# Altium project MD070B.PrjPcb (part 1 of 2)
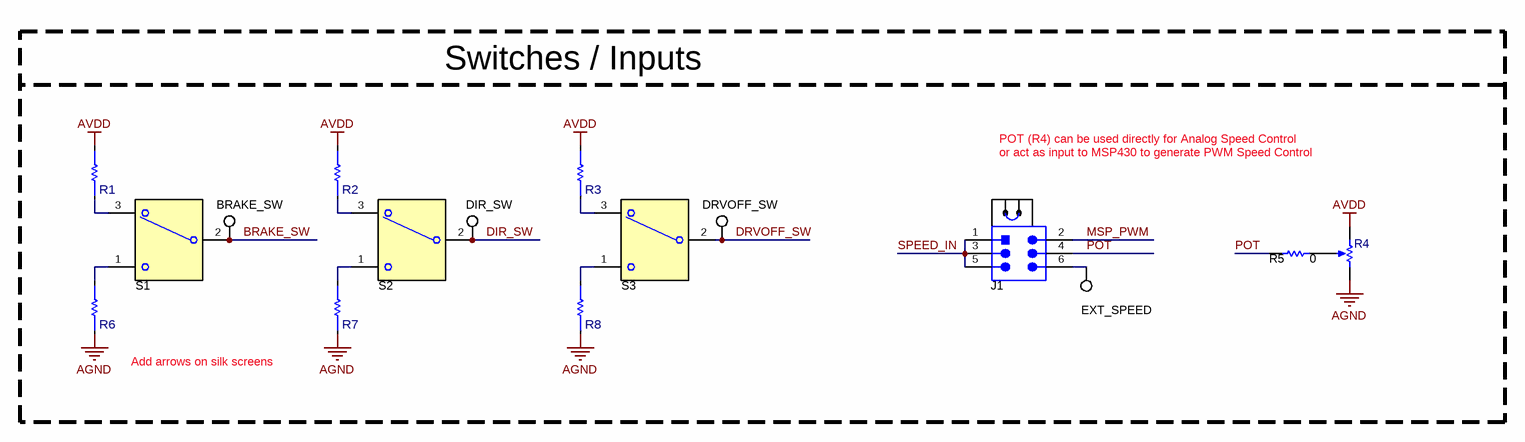
[diagram p0: MD070B_CONTROL.SchDoc]
TID: N/A; TechSupport: http://www.ti.com/support; SCH_Rev: B; ProjectVariant: EVM_Orderable; PRJ_Title: MCx8315AEVM; PRJ_Number: MD070; PRJ_Engineer: Eric Chen; PRJ_Customer: Public Release; PCB_Rev: B; PCB_Layout: Eric Chen; CopyrightYear: 2022
5 sheets, 162 parts. Net scope: global (net labels, ports and power ports of the same name join across sheets).
Board file: MD070B.PcbDoc
Sheets:
  MD070B_CONTROL.SchDoc
  MD070B_DRIVER.SchDoc
  MD070B_HARDWARE.SchDoc
  MD070B_INTERFACE.SchDoc
  MD070B_POWER_AND_CONNECTORS.SchDoc

## Sheet MD070B_CONTROL.SchDoc
size 431 x 279 mm; Date: Not shown in title block; ApprovedBy: Not shown in title block; CheckedBy: Not shown in title block; Author: Not shown in title block; CompanyName: Not shown in title block; Engineer: Not shown in title block; Organization: Not shown in title block; Address1: Not shown in title block; Address2: Not shown in title block; Address3: Not shown in title block; Address4: Not shown in title block; DocumentNumber: 1; Revision: Use project parameter SCH_Rev; SheetNumber: 2; SheetTotal: 5; PageSetup: Record=PageOptions|CenterHorizontal=True|CenterVertical=True|PrintScale=1.00|XCorrection=1.00|YCorrection=1.00|PrintKind=0|BorderSize=5000000|LeftOffset=0|BottomOffset=0|Orientation=2|PaperLength=1000|PaperWidth=1000|Scale=100|PaperSource=15|PrintQuality=600|MediaType=1|DitherType=10|PaperKind=Letter|PrintScaleMode=1; CurrentTime: Not shown in title block; CurrentDate: Not shown in title block; Time: Not shown in title block; DocumentFullPathAndName: Not shown in title block; DocumentName: Not shown in title block; ModifiedDate: Not shown in title block; ImagePath: Not shown in title block

### Parts
J1  Header_3x2  [TSW-103-07-G-D]  (value not drawn)
R1  ERA-3ARB103V  [FP-ERA-3ARB103V_0603-MFG]  (value not drawn)
R2  ERA-3ARB103V  [FP-ERA-3ARB103V_0603-MFG]  (value not drawn)
R3  ERA-3ARB103V  [FP-ERA-3ARB103V_0603-MFG]  (value not drawn)
R4  3352T-1-253LF  [Bourns_3352T]  (value not drawn)
R5  ValueDisplayed: 0  [0603L]  (hidden comment: ERJ-3GEY0R00V)
R6  ERA-3ARB103V  [FP-ERA-3ARB103V_0603-MFG]  (value not drawn)
R7  ERA-3ARB103V  [FP-ERA-3ARB103V_0603-MFG]  (value not drawn)
R8  ERA-3ARB103V  [FP-ERA-3ARB103V_0603-MFG]  (value not drawn)
S1  SW_SPDT_COM2_1_3  [SW_B12AP]  (value not drawn)
S2  SW_SPDT_COM2_1_3  [SW_B12AP]  (value not drawn)
S3  SW_SPDT_COM2_1_3  [SW_B12AP]  (value not drawn)
SH-J1  SNT-100-BK-G  [SNT-100-BK-G]  (value not drawn)
TP1  EXT_SPEED  [Keystone5002]
TP2  BRAKE_SW  [Keystone5002]
TP3  DIR_SW  [Keystone5002]
TP4  DRVOFF_SW  [Keystone5002]

### Nets
AGND: R4.3(CW) R6.1 R7.1 R8.1
AVDD: R1.2 R2.2 R3.2 R4.1(CCW)
BRAKE_SW: S1.2(COM) TP2.1
DIR_SW: S2.2(COM) TP3.1
DRVOFF_SW: S3.2(COM) TP4.1
MSP_PWM: J1.2
POT: J1.4 R5.1
SPEED_IN: J1.1 J1.3 J1.5
NetJ1_6: J1.6 TP1.1
NetR1_1: R1.1 S1.3
NetR2_1: R2.1 S2.3
NetR3_1: R3.1 S3.3
NetR4_2: R4.2(WIPER) R5.2
NetR6_2: R6.2 S1.1
NetR7_2: R7.2 S2.1
NetR8_2: R8.2 S3.1

### Notes on the sheet
- Switches / Inputs
- POT (R4) can be used directly for Analog Speed Control
- or act as input to MSP430 to generate PWM Speed Control
- Add arrows on silk screens
- Drawn By:
- SVN Rev:
- Number:
- TID #:
- Orderable:
- Rev:
- Sheet Title:
- File:
- Project Title:
- Designed for:
- Assembly Variant:
- Mod. Date:
- Sheet:
- Size:
- of
- B
- http://www.ti.com
- Texas Instruments and/or its licensors do not warrant the accuracy or completeness of this specification or any information contained therein. Texas Instruments and/or its licensors do not warrant that this design will meet the specifications, will be suitable for your application or fit for any particular purpose, or will operate in an implementation. Texas Instruments and/or its licensors do not warrant that the design is production worthy. You should completely validate and test your design implementation to confirm the system functionality for your application.
- Engineer:
- Contact:
- © Texas Instruments

### Library data of the parts
J1 = CMP-0075406-2: Header, 100mil, 3x2, Gold, TH; Manufacturer: Samtec; Pitch_mm: 2.54; Gender: Male; Shrouded: N; Row_Count: 2; Current_A: 6.3A; Voltage_V: 550V; Cert_CSA: Y; Green_Lifecycle: Active; Green_REACh: Passed; PartNumber: TSW-103-07-G-D; PackageReference: 3x2 Header; ClassName: Header; CompType: Header; RoHS: Y; MountType: TH; ComponentLink1Description: Datasheet URL; ComponentLink1URL: http://samtec.com/ftppub/pdf/TSW_TH.PDF; Orientation: Vertical; PinCount: 6; RowSpacing_mm: 2.54; ContactFinish: Gold; Color: Black; Cert_UL: Y; Cert_CULUS: N; Cert_VDE: N; Supplier 1: Digi-Key; Supplier Part Number 1: SAM1028-03-ND; Green_EU RoHS: Passed; Green_EU RoHS-2: Passed
R1-R3 R6-R8 = CMP-0092019-1: Res Thin Film 0603 10K Ohm 0.1% 1/10W ±10ppm/°C Molded SMD SMD Punched Carrier T/R; Manufacturer: Panasonic; AEC Grade: Grade 0; Power_W: 100mW; VDC_V: 75V; SizeZ_mm: 0.55mm; AEC Qualified: Yes; Res_ohm: 10k; Supplier 2: Mouser; ComponentLink1URL: https://industrial.panasonic.com/cdbs/www-data/pdf/RDM0000/AOA0000C307.pdf; Supplier Part Number 1: P10KBDCT-ND; RoHS: TRUE; Value: 10k; PartNumber: ERA-3ARB103V; PackageReference: 0603; Supplier 1: Digikey; ComponentLink1Description: Datasheet; Tolerance_%: 0.1%; Supplier Part Number 2: 667-ERA-3ARB103V; TempCo: 10ppm/°C; Technology: Thin Film; Mouser Description: Res Thin Film 0603 10K Ohm 0.1% 1/10W ±10ppm/°C Molded SMD SMD Punched Carrier T/R; Digikey Part Number: P10KBDCT-ND; Operating Temperature Range: -55°C to +155°C; Mouser Part Number: 667-ERA-3ARB103V; Part Number: ERA-3ARB103V; Series: ERA; Lead Free: Yes; Digikey Description: RES SMD 10K OHM 0.1% 1/10W 0603; helpURL: https://upverter.com/upn/revision/497126050f1df72a/; datasheet: https://industrial.panasonic.com/cdbs/www-data/pdf/RDM0000/AOA0000C307.pdf; Datasheet Path: datasheets/Res-ERA-3ARB103V.pdf
R4 = CMP-0001776-2: Trimmer Potentiometer, 25kohm, 0.5W, TH; Manufacturer: Bourns; Value: 25 kohm; Publisher: Texas Instruments; MountType: TH; ComponentLink1Description: Datasheet URL; Supplier 2: Newark; Supplier 3: Mouser; Supplier 1: Digi-Key; Supplier Part Number 1: 3352T-253LF-ND; Supplier Part Number 2: 32K8170; Supplier Part Number 3: 652-3352T-1-253LF; LatestRevisionDate: 09/03/2017; PartNumber: 3352T-1-253LF; PackageReference: 9.53x8.89mm; CompType: Trimmer; RoHS: Y; ComponentLink1URL: http://www.bourns.com/data/global/PDFs/3352.pdf
R5 = CMP-0025874-4: RES, 0, 5%, 0.1 W, AEC-Q200 Grade 0, 0603; Manufacturer: Panasonic; Power_W: 100mW; TempCo: 600 ppm/C; Value_Code: 0000; Value: 0; EIA_Code: E24; SizeX_mm: 1.6; SizeY_mm: 0.8; SizeZ_mm: 1; Value2: 0.1W; SizeArea_mm2: 1.28; AEC Qualified: Y; VDC_V: 50V; AEC Category: Q200; SizeAreaWB_mm2: 4.68; Supplier Part Number 2: 667-ERJ-3GEY0R00V; Supplier 2: Mouser; Supplier Part Number 3: 2059527; Supplier 3: Farnell; RoHS: Y; Value1: 5%; MountType: SMT; Supplier 1: Digi-Key; PackageReference: 0603; Tolerance_%: 5%; Res_ohm: 0; CompType: Resistor; PartNumber: ERJ-3GEY0R00V; ComponentLink1Description: Datasheet link; Supplier Part Number 1: P0.0GCT-ND; Technology: Thick Film; ComponentLink1URL: https://industrial.panasonic.com/cdbs/www-data/pdf/RDA0000/AOA0000C301.pdf; AEC Grade: 0
S1-S3 = CMP-0002155-2: SWITCH TOGGLE SPDT 0.4VA 28V; PartNumber: B12AP; Manufacturer: NKK Switches; SwitchFunction: On-On; PositionCount: 2; CurrentRating_mA: 100A; MountType: TH; ComponentLink1Description: Datasheet URL; ComponentLink1URL: http://www.nkkswitches.com/pdf/Btoggles.pdf; RoHS: Y; Circuit: SPDT; VDC_V: 28V; Orientation: Top Actuated; CompType: Switch; PackageReference: 6.8x23.1x8.8mm; Publisher: Texas Instruments; LatestRevisionDate: 2017-03-09; Supplier 1: Digi-Key; Supplier Part Number 1: 360-1012-ND; Supplier 2: Newark; Supplier Part Number 2: 09X8543; Supplier 3: Mouser; Supplier Part Number 3: 633-B12AP
SH-J1 = CMP-0003623-3: Shunt, 100mil, Gold plated, Black; Alternate PartNumber: 969102-0000-DA; Manufacturer: Samtec; Alternate Manufacturer: 3M; Value: 1x2; ComponentLink1URL: http://www.samtec.com/ftppub/pdf/SNT.PDF; Supplier 1: Digi-Key; CompType: Shunt; PackageReference: Shunt; ClassName: Shunt; RoHS: Y; Supplier Part Number 1: SAM8858-ND; MountType: N/A; PartNumber: SNT-100-BK-G; ComponentLink1Description: Datasheet Link
TP1-TP4 = CMP-0055139-1: Test Point, Miniature, White, TH; Manufacturer: Keystone; CNHeader: FALSE; Green_Lifecycle: Active; Green_REACh: Passed; ContactFinish: Silver; CT: TRUE; ComponentLink1URL: http://www.keyelco.com/userAssets/file/M60-2p60.pdf; Supplier Part Number 2: 82H9632; Publisher: Texas Instruments; Supplier 2: Newark; Supplier Part Number 3: 534-5002; Color: White; Supplier 3: Mouser; RoHS: Y; MountType: TH; Green_EU RoHS-2: Passed; Supplier 1: Digi-Key; Green_EU RoHS: Passed; PackageReference: White Miniature Testpoint; CompType: Test Point; LatestRevisionDate: 26/05/2017; PartNumber: 5002; ComponentLink1Description: Datasheet URL; Supplier Part Number 1: 36-5002-ND

## Sheet MD070B_DRIVER.SchDoc
size 431 x 279 mm; Date: Not shown in title block; ApprovedBy: Not shown in title block; CheckedBy: Not shown in title block; Author: Not shown in title block; CompanyName: Not shown in title block; Engineer: Not shown in title block; Organization: Not shown in title block; Address1: Not shown in title block; Address2: Not shown in title block; Address3: Not shown in title block; Address4: Not shown in title block; DocumentNumber: 2; Revision: Use project parameter SCH_Rev; SheetNumber: 3; SheetTotal: 5; PageSetup: Record=PageOptions|CenterHorizontal=True|CenterVertical=True|PrintScale=1.00|XCorrection=1.00|YCorrection=1.00|PrintKind=0|BorderSize=5000000|LeftOffset=0|BottomOffset=0|Orientation=2|PaperLength=1000|PaperWidth=1000|Scale=100|PaperSource=15|PrintQuality=600|MediaType=1|DitherType=10|PaperKind=Letter|PrintScaleMode=1; CurrentTime: Not shown in title block; CurrentDate: Not shown in title block; Time: Not shown in title block; DocumentFullPathAndName: Not shown in title block; DocumentName: Not shown in title block; ModifiedDate: Not shown in title block; ImagePath: Not shown in title block
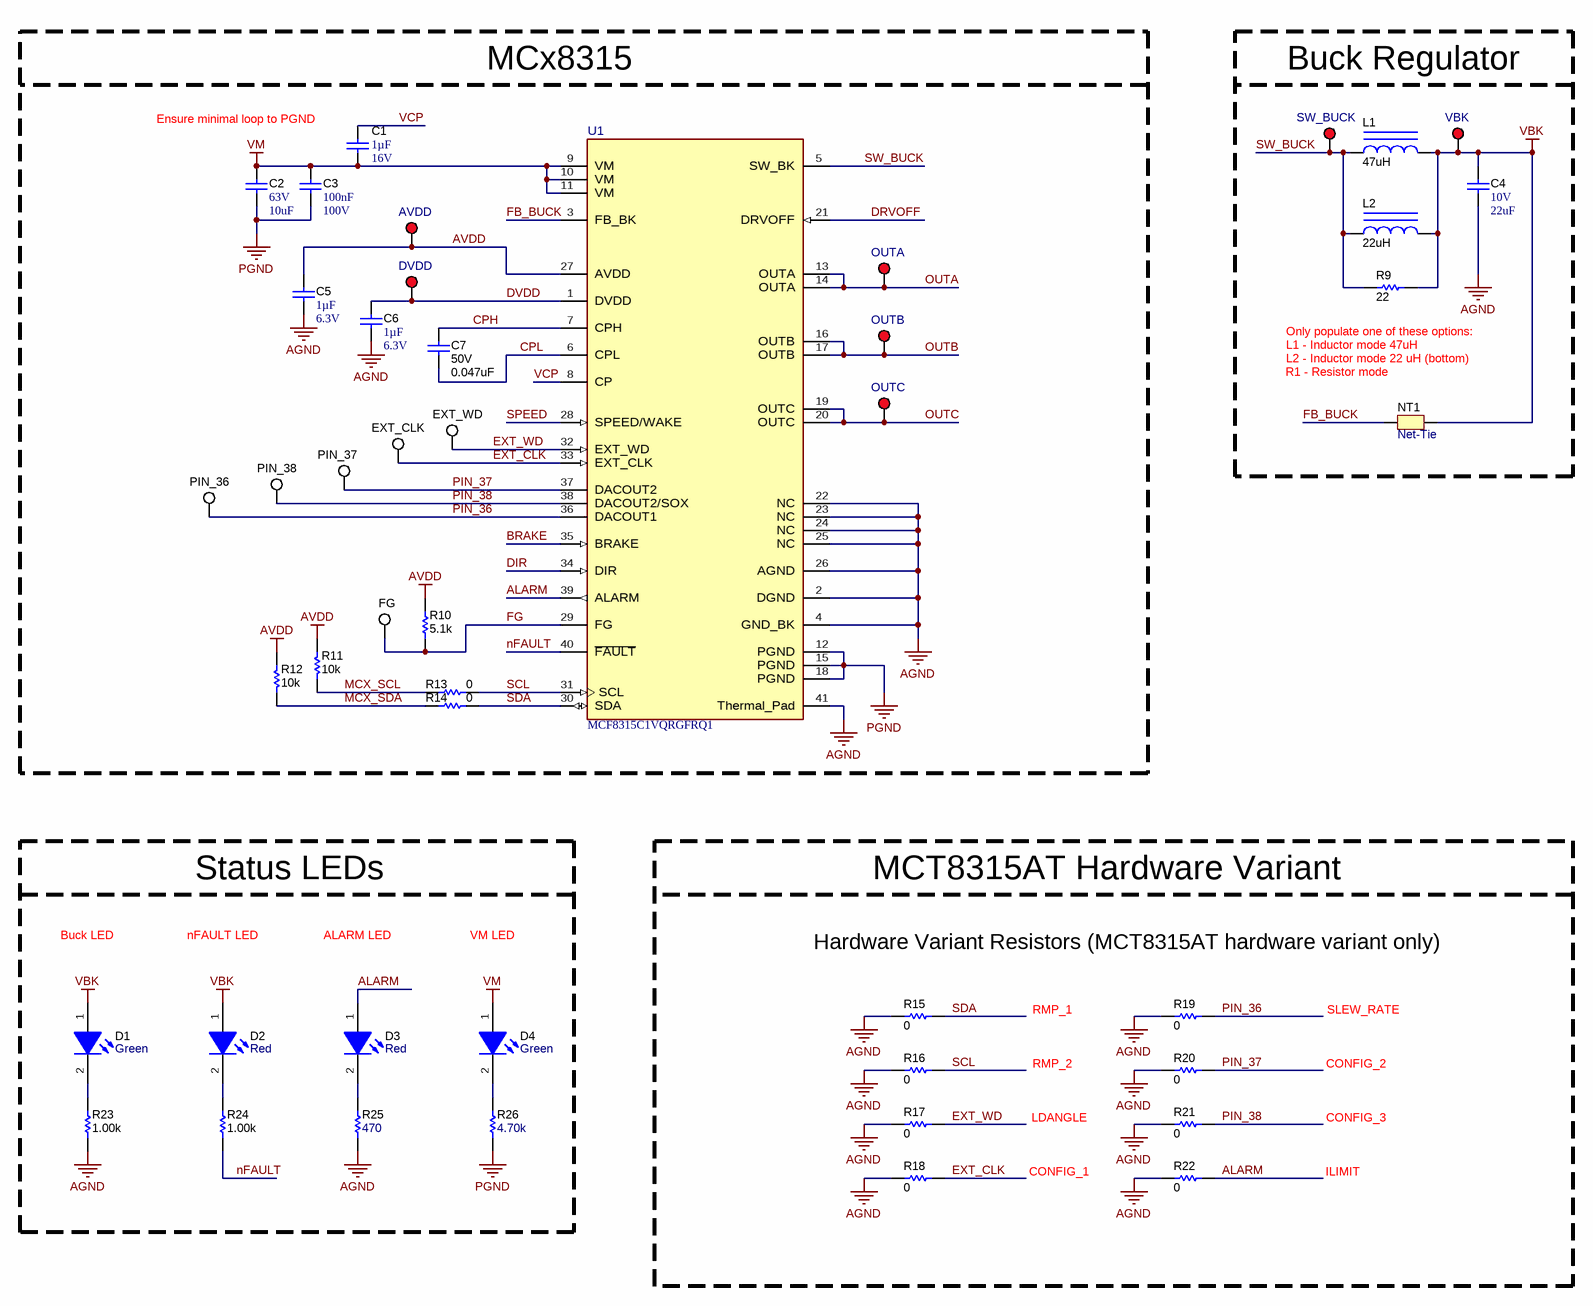
[diagram p1: MD070B_DRIVER.SchDoc]

### Parts
C1  Cap_F: 1µF  VDC_V: 16V  [0603L]  (hidden comment: EMK107B7105KAHT)
C2  VDC_V: 63V  ValueDisplayed: 10uF  [1210_270L]  (hidden comment: GRM32ER71J106KA12L)
C3  Cap_F: 100nF  VDC_V: 100V  [0603]  (hidden comment: GRM188R72A104KA35D)
C4  VDC_V: 10V  ValueDisplayed: 22uF  [1206_180L]  (hidden comment: GRM31CR71A226KE15L)
C5  Cap_F: 1µF  VDC_V: 6.3V  [0603L]  (hidden comment: C0603C105K9RACAUTO)
C6  Cap_F: 1µF  VDC_V: 6.3V  [0603L]  (hidden comment: C0603C105K9RACAUTO)
C7  VDC_V: 50V  ValueDisplayed: 0.047uF  [0402L]  (hidden comment: C1005X7R1H473K050BB)
D1  value Green  [LTST-C170KGKT_Green]  (hidden comment: LTST-C170KGKT)
D2  value Red  [LED_LTST-C170_Red]  (hidden comment: LTST-C170KRKT)
D3  value Red  [LED_LTST-C170_Red]  (hidden comment: LTST-C170KRKT)
D4  value Green  [LTST-C170KGKT_Green]  (hidden comment: LTST-C170KGKT)
L1  ValueDisplayed: 47uH  [WE-MAIA_3015]  (hidden comment: 78438335470)
L2  ValueDisplayed: 22uH  [WE-MAIA_3015]  (hidden comment: 78438335220)
NT1  Net-Tie  [Net-Tie_10mil]  (net tie, no BOM)
R9  ValueDisplayed: 22  [2512]  (hidden comment: CRCW251222R0JNEGHP)
R10  ValueDisplayed: 5.1k  [0603L]  (hidden comment: CRCW06035K10JNEA)
R11  ValueDisplayed: 10k  [0603]  (hidden comment: CRCW060310K0JNEA)
R12  ValueDisplayed: 10k  [0603]  (hidden comment: CRCW060310K0JNEA)
R13  ValueDisplayed: 0  [0603L]  (hidden comment: ERJ-3GEY0R00V)
R14  ValueDisplayed: 0  [0603L]  (hidden comment: ERJ-3GEY0R00V)
R15  ValueDisplayed: 0  [0603L]  (hidden comment: ERJ-3GEY0R00V)
R16  ValueDisplayed: 0  [0603L]  (hidden comment: ERJ-3GEY0R00V)
R17  ValueDisplayed: 0  [0603L]  (hidden comment: ERJ-3GEY0R00V)
R18  ValueDisplayed: 0  [0603L]  (hidden comment: ERJ-3GEY0R00V)
R19  ValueDisplayed: 0  [0603L]  (hidden comment: ERJ-3GEY0R00V)
R20  ValueDisplayed: 0  [0603L]  (hidden comment: ERJ-3GEY0R00V)
R21  ValueDisplayed: 0  [0603L]  (hidden comment: ERJ-3GEY0R00V)
R22  ValueDisplayed: 0  [0603L]  (hidden comment: ERJ-3GEY0R00V)
R23  ValueDisplayed: 1.00k  [0603]  (hidden comment: RC0603FR-071KL)
R24  ValueDisplayed: 1.00k  [0603]  (hidden comment: RC0603FR-071KL)
R25  ValueDisplayed: 470  [0603]  (hidden comment: RC0603JR-07470RL)
R26  ValueDisplayed: 4.70k  [0603L]  (hidden comment: RT0603BRD074K7L)
TP5  SW_BUCK  [Keystone5000]
TP6  VBK  [Keystone5000]
TP7  AVDD  [Keystone5000]
TP8  DVDD  [Keystone5000]
TP9  OUTA  [Keystone5000]
TP10  OUTB  [Keystone5000]
TP11  OUTC  [Keystone5000]
TP12  EXT_WD  [Keystone5002]
TP13  EXT_CLK  [Keystone5002]
TP14  PIN_37  [Keystone5002]
TP15  PIN_38  [Keystone5002]
TP16  PIN_36  [Keystone5002]
TP17  FG  [Keystone5002]
U1  MCF8315C1VQRGFRQ1  [RGF0040F-MFG]

### Blocks framed on the sheet
MCx8315: C1-C3 C5-C7 R10-R14 TP7-TP17 U1
Buck Regulator: C4 L1 L2 NT1 R9 TP5 TP6
Status LEDs: D1-D4 R23-R26
MCT8315AT Hardware Variant: R15-R22

### Nets
AGND: C4.2 C5.1 C6.1 R15.2 R16.2 R17.2 R18.2 R19.2 R20.2 R21.2 R22.2 R23.1 R25.1 U1.2(DGND) U1.4(GND_BK) U1.22(NC) U1.23(NC) U1.24(NC) U1.25(NC) U1.26(AGND) U1.41(Thermal_Pad)
AVDD: C5.2 R10.2 R11.1 R12.1 TP7.1 U1.27(AVDD)
PGND: C2.2 C3.2 R26.1 U1.12(PGND) U1.15(PGND) U1.18(PGND)
VBK: C4.1 D1.1(A) D2.1(A) L1.2 L2.2 NT1.2 R9.2 TP6.1
VM: C1.2 C2.1 C3.1 D4.1(A) U1.9(VM) U1.10(VM) U1.11(VM)
ALARM: D3.1(A) R22.1 U1.39(ALARM)
BRAKE: U1.35(BRAKE)
CPH: C7.1 U1.7(CPH)
CPL: C7.2 U1.6(CPL)
DIR: U1.34(DIR)
DRVOFF: U1.21(DRVOFF)
DVDD: C6.2 TP8.1 U1.1(DVDD)
EXT_CLK: R18.1 TP13.1 U1.33(EXT_CLK)
EXT_WD: R17.1 TP12.1 U1.32(EXT_WD)
FB_BUCK: NT1.1 U1.3(FB_BK)
FG: R10.1 TP17.1 U1.29(FG)
MCX_SCL: R11.2 R13.1
MCX_SDA: R12.2 R14.1
nFAULT: R24.1 U1.40(~{FAULT})
OUTA: TP9.1 U1.13(OUTA) U1.14(OUTA)
OUTB: TP10.1 U1.16(OUTB) U1.17(OUTB)
OUTC: TP11.1 U1.19(OUTC) U1.20(OUTC)
PIN_36: R19.1 TP16.1 U1.36(DACOUT1)
PIN_37: R20.1 TP14.1 U1.37(DACOUT2)
PIN_38: R21.1 TP15.1 U1.38(DACOUT2/SOX)
SCL: R13.2 R16.1 U1.31(SCL)
SDA: R14.2 R15.1 U1.30(SDA)
SPEED: U1.28(SPEED/WAKE)
SW_BUCK: L1.1 L2.1 R9.1 TP5.1 U1.5(SW_BK)
VCP: C1.1 U1.8(CP)
NetD1_2: D1.2(K) R23.2
NetD2_2: D2.2(K) R24.2
NetD3_2: D3.2(K) R25.2
NetD4_2: D4.2(K) R26.2

### Notes on the sheet
- Ensure minimal loop to PGND
- (near NT1) R1 - Resistor mode
- L1 - Inductor mode 47uH
- L2 - Inductor mode 22 uH (bottom)
- (near R9) Only populate one of these options:
- Buck LED
- nFAULT LED
- ALARM LED
- VM LED
- Hardware Variant Resistors (MCT8315AT hardware variant only)
- RMP_1
- RMP_2
- CONFIG_2
- SLEW_RATE
- LDANGLE
- CONFIG_3
- CONFIG_1
- ILIMIT
- Drawn By:
- SVN Rev:
- Number:
- TID #:
- Orderable:
- Rev:
- Sheet Title:
- File:
- Project Title:
- Designed for:
- Assembly Variant:
- Mod. Date:
- Sheet:
- Size:
- of
- B
- http://www.ti.com
- Texas Instruments and/or its licensors do not warrant the accuracy or completeness of this specification or any information contained therein. Texas Instruments and/or its licensors do not warrant that this design will meet the specifications, will be suitable for your application or fit for any particular purpose, or will operate in an implementation. Texas Instruments and/or its licensors do not warrant that the design is production worthy. You should completely validate and test your design implementation to confirm the system functionality for your application.
- Engineer:
- Contact:
- © Texas Instruments

### Library data of the parts
C1 = CMP-0080104-1: CAP, CERM, 1 µF, 16 V,+/- 10%, X7R, AEC-Q200 Grade 1, 0603; Manufacturer: Taiyo Yuden; SizeAreaWB_mm2: 4.68; SizeArea_mm2: 1.28; AEC Qualified: Y; AEC Category: Q200; Value: 1uF; TaMax_C: 125°C; SizeZ_mm: 1; Polarized: N; TaMin_C: -55°C; SizeY_mm: 0.8; U/M: EA; SizeX_mm: 1.6; Cap_Case: 0603; ComponentLink1Description: Datasheet link; RoHS: Y; Supplier Part Number 3: 963-EMK107B7105KAHT; Tolerance_%: 10%; Supplier 1: Digi-Key; PackageReference: 0603; Technology: Ceramic; PartNumber: EMK107B7105KAHT; TempCo: X7R; Supplier Part Number 2: 68X1305; Supplier 2: Newark; AEC Grade: 1; Value2: 16V; ComponentLink1URL: https://www.yuden.co.jp/productdata/catalog/mlcc01_hq_e.pdf; CompType: Capacitor; MountType: SMT; Supplier Part Number 1: 587-3305-1-ND; Supplier 3: Mouser; ValueDisplayed: 1µF
C2 = CMP-0009229-2: CAP, CERM, 10 uF, 63 V, +/- 10%, X7R, 1210; Manufacturer: MuRata; TaMin_C: -55°C; Polarized: N; SizeAreaWB_mm2: 14.7; Value1: Unknown; U/M: EA; Value: 10uF; TaMax_C: 125°C; SizeZ_mm: 2.7; SizeX_mm: 3.2; SizeY_mm: 2.5; Cap_Case: 1210; SizeArea_mm2: 8; Cap_F: 10µF; AEC Category: Q200; Supplier Part Number 2: 81-GRM32ER71J106KA2L; Publisher: Texas Instruments; Supplier 2: Mouser; TempCo: X7R; Published: 2008-06-19; RoHS: Y; MountType: SMT; Supplier 1: Digi-Key; PackageReference: 1210; Tolerance_%: 10%; Value2: 63V; CompType: Capacitor; LatestRevisionDate: 2017-03-09; PartNumber: GRM32ER71J106KA12L; AEC Qualified: N; ComponentLink1Description: Datasheet link; AEC Grade: N/A; Supplier Part Number 1: 490-9970-1-ND; Technology: Ceramic; ComponentLink1URL: http://psearch.en.murata.com/capacitor/product/GRM32ER71J106KA12%23.pdf
C3 = CMP-0007469-4: CAP, CERM, 0.1 uF, 100 V, +/- 10%, X7R, 0603; Manufacturer: MuRata; TaMin_C: -55°C; TaMax_C: 125°C; SizeY_mm: 0.8; ValueDisplayed: 0.1uF; SizeZ_mm: 1; Polarized: N; Value1: Unknown; U/M: EA; SizeAreaWB_mm2: 4.68; AEC Category: Q200; SizeArea_mm2: 1.28; Value: 0.1uF; SizeX_mm: 1.6; CompType: Capacitor; AEC Qualified: ?; Supplier 3: Farnell; Technology: Ceramic; TempCo: X7R; RoHS: Y; Cap_Case: 0603; Supplier 1: Digi-Key; Supplier Part Number 1: 490-3285-1-ND; Tolerance_%: 10%; MountType: SMT; ComponentLink1Description: Datasheet link; Supplier Part Number 2: 81-GRM188R72A104KA35; Value2: 100V; PartNumber: GRM188R72A104KA35D; Supplier 2: Mouser; ComponentLink1URL: http://search.murata.co.jp/Ceramy/PnsearchViewAction.do?HnOFG=ON&HnNFG=ON&SEL_CNT=50&sLang=en&sKey=GRM188R72A104KA35D&x=9&y=9&search=startwith; Supplier Part Number 3: 1828921; PackageReference: 0603; Publisher: Texas Instruments; Published: 2008-06-19; LatestRevisionDate: 2017-03-09
C4 = CMP-0008959-2: CAP, CERM, 22 uF, 10 V, +/- 10%, X7R, 1206; Manufacturer: MuRata; TaMin_C: -55°C; Polarized: N; SizeAreaWB_mm2: 10.92; Value1: Unknown; U/M: EA; Value: 22uF; TaMax_C: 125°C; SizeZ_mm: 1.8; SizeX_mm: 3.2; SizeY_mm: 1.6; Cap_Case: 1206; SizeArea_mm2: 5.12; Cap_F: 22µF; AEC Category: Q200; Supplier Part Number 2: 81-GRM31CR71A226K15L; Publisher: Texas Instruments; Supplier 2: Mouser; Supplier Part Number 3: 1797016; TempCo: X7R; Supplier 3: Farnell; Published: 2008-06-19; RoHS: Y; MountType: SMT; Supplier 1: Digi-Key; PackageReference: 1206; Tolerance_%: 10%; Value2: 10V; CompType: Capacitor; LatestRevisionDate: 2017-03-09; PartNumber: GRM31CR71A226KE15L; AEC Qualified: ?; ComponentLink1Description: Datasheet link; Supplier Part Number 1: 490-5309-1-ND; Technology: Ceramic; ComponentLink1URL: http://search.murata.co.jp/Ceramy/PnsearchViewAction.do?HnOFG=ON&HnNFG=ON&SEL_CNT=50&sLang=en&sKey=GRM31CR71A226KE15L&x=9&y=9&search=startwith
C5 C6 = CMP-0086190-1: CAP, CERM, 1 µF, 6.3 V,+/- 10%, X7R, AEC-Q200 Grade 1, 0603; Manufacturer: Kemet; SizeArea_mm2: 1.28; Cap_Case: 0603; SizeY_mm: 0.8; AEC Category: Q200; AEC Qualified: Y; TaMax_C: 125°C; SizeZ_mm: 1; SizeX_mm: 1.6; Polarized: N; Value: 1uF; SizeAreaWB_mm2: 4.68; TaMin_C: -55°C; U/M: EA; ComponentLink1URL: https://content.kemet.com/datasheets/KEM_C1023_X7R_AUTO_SMD.pdf; CompType: Capacitor; PackageReference: 0603; Value2: 6.3V; Technology: Ceramic; RoHS: Y; MountType: SMT; PartNumber: C0603C105K9RACAUTO; AEC Grade: 1; ComponentLink1Description: Datasheet link; TempCo: X7R; Tolerance_%: 10%; ValueDisplayed: 1µF
C7 = CMP-0006298-2: CAP, CERM, 0.047 uF, 50 V, +/- 10%, X7R, 0402; Manufacturer: TDK; TaMin_C: -55°C; ESR_ohm: 0.06407; Polarized: N; SizeAreaWB_mm2: 3; Value1: 0.06407 ohm; U/M: EA; SizeZ_mm: 0.6; SizeX_mm: 1; SizeY_mm: 0.5; Cap_Case: 0402; Cap_F: 47nF; IRMS_A: 646.122mA; AEC Category: Q200; TaMax_C: 125°C; ComponentLink1URL: https://product.tdk.com/en/search/capacitor/ceramic/mlcc/info?part_no=C1005X7R1H473K050BB; Supplier Part Number 2: 04X3233; Publisher: Texas Instruments; Supplier 2: Newark; Supplier Part Number 3: 810-C1005X7R1H473K; TempCo: X7R; Supplier 3: Mouser; Published: 2008-06-19; RoHS: Y; MountType: SMT; Value: 0.047uF; Supplier 1: Digi-Key; PackageReference: 0402; Tolerance_%: 10%; Value2: 50V; SizeArea_mm2: 0.5; CompType: Capacitor; LatestRevisionDate: 2017-03-09; PartNumber: C1005X7R1H473K050BB; AEC Qualified: N; ComponentLink1Description: Datasheet link; AEC Grade: N/A; Supplier Part Number 1: 445-7336-1-ND; Technology: Ceramic
D1 D4 = CMP-0002888-2: LED, Green, SMD; Manufacturer: Lite-On; Io_A: 20mA; Value1: W; Vf_V: 2V; Type: AlInGaP; ComponentLink1URL: http://optoelectronics.liteon.com/upload/download/DS22-2000-073/S_110_LTST-C170KGKT.pdf; Color: Green; RoHS: Y; MountType: SMT; PackageReference: LED_0805; Value2: 2V; CompType: LED; PartNumber: LTST-C170KGKT; ComponentLink1Description: Datasheet link
D2 D3 = CMP-0002829-3: LED, Red, SMD; Manufacturer: Lite-On; Io_A: 20mA; SizeAreaWB_mm2: 6.75; Value1: W; SizeZ_mm: 1.2; SizeX_mm: 2; SizeY_mm: 1.25; Vf_V: 2V; SizeArea_mm2: 2.5; Type: AlInGaP; ComponentLink1URL: http://optoelectronics.liteon.com/upload/download/DS-22-99-0150/P_100_LTST-C170KRKT.pdf; Color: red; RoHS: Y; MountType: SMT; PackageReference: Red 0805 LED; Value2: 2V; CompType: LED; PartNumber: LTST-C170KRKT; ComponentLink1Description: Datasheet link
L1 = CMP-0064683-2: Inductor, Shielded, Powdered Iron, 47 uH, 0.39 A, 2.3 ohm, AEC-Q200 Grade 1, SMD; Manufacturer: Wurth Elektronik; Isat: 1.18A @ 20% inductance drop; Irms: 0.39A @ 40C rise; SizeAreaWB_mm2: 16; DCR_ohm: 2.3; Value1: 2.3 ohm; Value: 47uH; Imax_A: 390mA; SizeZ_mm: 1.5; SizeX_mm: 3; Value2: 0.39A; SizeArea_mm2: 9; Ind_H: 47µH; AEC Qualified: Y; AEC Grade: 1; AEC Category: Q200; Publisher: Texas Instruments; Published: 2008-06-26; RoHS: Y; Material: Powdered Iron; MountType: SMT; Supplier 1: Digi-Key; PackageReference: SMD, 2-Leads, Body 3x3mm; SizeY_mm: 3; CompType: Inductor; LatestRevisionDate: 2017-06-02; PartNumber: 78438335470; ComponentLink1Description: Datasheet link; Supplier Part Number 1: 732-6947-1-ND; Technology: Shielded; ComponentLink1URL: http://katalog.we-online.de/pbs/datasheet/78438335470.pdf
L2 = CMP-0064681-2: Inductor, Shielded, Powdered Iron, 22 uH, 0.6 A, 1.04 ohm, AEC-Q200 Grade 1, SMD; Manufacturer: Wurth Elektronik; Isat: 1.6A @ 20% inductance drop; Irms: 0.6A @ 40C rise; SizeAreaWB_mm2: 16; DCR_ohm: 1.04; Value: 22uH; Imax_A: 600mA; SizeZ_mm: 1.5; SizeX_mm: 3; Value2: 0.6A; SizeArea_mm2: 9; Ind_H: 22µH; AEC Qualified: Y; AEC Grade: 1; AEC Category: Q200; Publisher: Texas Instruments; Published: 2008-06-26; RoHS: Y; Value1: 1.04 ohm; Material: Powdered Iron; MountType: SMT; Supplier 1: Digi-Key; PackageReference: SMD, 2-Leads, Body 3x3mm; SizeY_mm: 3; CompType: Inductor; LatestRevisionDate: 2017-06-02; PartNumber: 78438335220; ComponentLink1Description: Datasheet link; Supplier Part Number 1: 732-6945-1-ND; Technology: Shielded; ComponentLink1URL: http://katalog.we-online.de/pbs/datasheet/78438335220.pdf
NT1 = CMP-0078142-4: Single point connection between nets.; MountType: SMT; PackageReference: N/A; CompType: Net-Tie; Manufacturer: N/A; PartNumber: N/A; Library Reference: Net-Tie
R9 = CMP-0015919-3: RES, 22, 5%, 1.5 W, AEC-Q200 Grade 0, 2512; Manufacturer: Vishay-Dale; Power_W: 1.5W; TempCo: 200 ppm/C; Value_Code: 22R0; Value: 22; EIA_Code: E24; SizeX_mm: 6.3; SizeY_mm: 3.2; SizeZ_mm: 0.71; SizeArea_mm2: 20.16; AEC Qualified: Y; VDC_V: 500V; AEC Category: Q200; AEC Grade: 0; RoHS: E; Value1: 5%; MountType: SMT; PackageReference: 2512; Tolerance_%: 5%; Res_ohm: 22; Value2: 1.5W; CompType: Resistor; PartNumber: CRCW251222R0JNEGHP; ComponentLink1Description: Datasheet link; Technology: Thick Film; ComponentLink1URL: http://www.vishay.com/docs/20043/crcwhpe3.pdf
R10 = CMP-0025830-4: RES, 5.1 k, 5%, 0.1 W, AEC-Q200 Grade 0, 0603; Manufacturer: Vishay-Dale; Power_W: 100mW; TempCo: 200 ppm/C; Value_Code: 5k10; Value: 5.1k; EIA_Code: E24; SizeX_mm: 1.6; SizeY_mm: 0.8; SizeZ_mm: 1; Value2: 0.1W; SizeArea_mm2: 1.28; AEC Qualified: Y; VDC_V: 75V; AEC Category: Q200; AEC Grade: 0; ComponentLink1URL: http://www.vishay.com/docs/20035/dcrcwe3.pdf; Supplier Part Number 2: 89M6773; Supplier 2: Newark; Supplier Part Number 3: 1570751; Supplier 3: Farnell; RoHS: E; Value1: 5%; MountType: SMT; Supplier 1: Digi-Key; PackageReference: 0603; Tolerance_%: 5%; Res_ohm: 5.1k; CompType: Resistor; PartNumber: CRCW06035K10JNEA; ComponentLink1Description: Datasheet link; Supplier Part Number 1: 541-5.1KGCT-ND; Technology: Thick Film
R11 R12 = CMP-0025701-4: RES, 10 k, 5%, 0.1 W, AEC-Q200 Grade 0, 0603; Manufacturer: Vishay-Dale; Power_W: 100mW; TempCo: 200 ppm/C; Value_Code: 10k0; Value: 10k; EIA_Code: E24; SizeX_mm: 1.6; SizeY_mm: 0.8; SizeZ_mm: 1; Value2: 0.1W; SizeArea_mm2: 1.28; AEC Qualified: Y; VDC_V: 75V; AEC Category: Q200; AEC Grade: 0; Supplier Part Number 2: 52K8066; Supplier 2: Newark; Supplier Part Number 3: 71-CRCW0603J-10K-E3; Supplier 3: Mouser; RoHS: E; Value1: 5%; MountType: SMT; Supplier 1: Digi-Key; PackageReference: 0603; Tolerance_%: 5%; Res_ohm: 10k; CompType: Resistor; PartNumber: CRCW060310K0JNEA; ComponentLink1Description: Datasheet link; Supplier Part Number 1: 541-10KGCT-ND; Technology: Thick Film; ComponentLink1URL: http://www.vishay.com/docs/20035/dcrcwe3.pdf
R13-R22 = CMP-0025874-4: as R5 on sheet MD070B_CONTROL; Supplier Part Number 2: 667-ERJ-3GEY0R00V; Supplier 2: Mouser; Supplier Part Number 3: 2059527; Supplier 3: Farnell; RoHS: Y; Value1: 5%; MountType: SMT; Supplier 1: Digi-Key; PackageReference: 0603; Tolerance_%: 5%; Res_ohm: 0; CompType: Resistor; PartNumber: ERJ-3GEY0R00V; ComponentLink1Description: Datasheet link; Supplier Part Number 1: P0.0GCT-ND; Technology: Thick Film; ComponentLink1URL: https://industrial.panasonic.com/cdbs/www-data/pdf/RDA0000/AOA0000C301.pdf; AEC Grade: 0
R23 R24 = CMP-0022895-5: RES, 1.00 k, 1%, 0.1 W, 0603; Manufacturer: Yageo; Power_W: 100mW; TempCo: 100 ppm/C; Value_Code: 1k00; Value: 1.00k; EIA_Code: E96; Res_ohm: 1k; SizeX_mm: 1.6; SizeY_mm: 0.8; SizeZ_mm: 1; Value2: 0.1W; SizeArea_mm2: 1.28; AEC Qualified: N; VDC_V: 75V; AEC Category: Q200; SizeAreaWB_mm2: 4.68; Supplier Part Number 2: 603-RC0603FR-071KL; Supplier 2: Mouser; Supplier Part Number 3: 9238484; Supplier 3: Farnell; RoHS: Y; Value1: 1%; MountType: SMT; Supplier 1: Digi-Key; PackageReference: 0603; Tolerance_%: 1%; CompType: Resistor; PartNumber: RC0603FR-071KL; ComponentLink1Description: Datasheet link; Supplier Part Number 1: 311-1.00KHRCT-ND; Technology: Thick Film; ComponentLink1URL: http://www.yageo.com/pdf/Pu-RC0603_51_PbFree_L_2.pdf; AEC Grade: N/A
R25 = CMP-0025924-5: RES, 470, 5%, 0.1 W, 0603; Manufacturer: Yageo; Power_W: 100mW; TempCo: 100 ppm/C; Value_Code: 470R; Value: 470; EIA_Code: E24; SizeX_mm: 1.6; SizeY_mm: 0.8; SizeZ_mm: 1; Value2: 0.1W; SizeArea_mm2: 1.28; AEC Qualified: N; VDC_V: 75V; AEC Category: Q200; SizeAreaWB_mm2: 4.68; Supplier Part Number 2: 603-RC0603JR-07470RL; Supplier 2: Mouser; Supplier Part Number 3: 9233334; Supplier 3: Farnell; RoHS: Y; Value1: 5%; MountType: SMT; Supplier 1: Digi-Key; PackageReference: 0603; Tolerance_%: 5%; Res_ohm: 470; CompType: Resistor; PartNumber: RC0603JR-07470RL; ComponentLink1Description: Datasheet link; Supplier Part Number 1: 311-470GRCT-ND; Technology: Thick Film; ComponentLink1URL: http://www.yageo.com/pdf/Pu-RC0603_51_PbFree_L_2.pdf; AEC Grade: N/A
R26 = CMP-0024300-2: RES, 4.70 k, 0.1%, 0.1 W, 0603; Manufacturer: Yageo America; Power_W: 100mW; TempCo: 25 ppm/C; Value_Code: 4k70; U/M: EA; Value: 4.70k; EIA_Code: E192; Res_ohm: 4.7k; SizeX_mm: 1.6; SizeY_mm: 0.8; SizeZ_mm: 1; Value2: 0.1W; SizeArea_mm2: 1.28; VDC_V: 75V; AEC Category: Q200; ComponentLink1URL: http://www.yageo.com/pdf/PYu-RT_1-to-0.05_RoHS_L_3.pdf; Publisher: Texas Instruments; Published: 2008-06-26; RoHS: Y; Value1: 0.1%; MountType: SMT; PackageReference: 0603; Tolerance_%: 0.1%; CompType: Resistor; LatestRevisionDate: 2017-03-09; PartNumber: RT0603BRD074K7L; AEC Qualified: ?; ComponentLink1Description: Datasheet link; Technology: Thin Film
TP5-TP11 = CMP-0055137-1: Test Point, Miniature, Red, TH; PartNumber: 5000; Manufacturer: Keystone; ContactFinish: Silver; CNHeader: FALSE; CT: TRUE; Green_Lifecycle: Active; Green_REACh: Passed; PackageReference: Red Miniature Testpoint; CompType: Test Point; RoHS: Y; MountType: TH; ComponentLink1Description: Datasheet URL; ComponentLink1URL: http://www.keyelco.com/userAssets/file/M60-2p60.pdf; Publisher: Texas Instruments; LatestRevisionDate: 26/05/2017; Supplier 1: Digi-Key; Supplier Part Number 1: 36-5000-ND; Supplier 2: Mouser; Supplier Part Number 2: 534-5000; Color: Red; Green_EU RoHS-2: Incomplete; Green_EU RoHS: Passed
TP12-TP17 = CMP-0055139-1: as TP1 on sheet MD070B_CONTROL; ComponentLink1URL: http://www.keyelco.com/userAssets/file/M60-2p60.pdf; Supplier Part Number 2: 82H9632; Publisher: Texas Instruments; Supplier 2: Newark; Supplier Part Number 3: 534-5002; Color: White; Supplier 3: Mouser; RoHS: Y; MountType: TH; Green_EU RoHS-2: Passed; Supplier 1: Digi-Key; Green_EU RoHS: Passed; PackageReference: White Miniature Testpoint; CompType: Test Point; LatestRevisionDate: 26/05/2017; PartNumber: 5002; ComponentLink1Description: Datasheet URL; Supplier Part Number 1: 36-5002-ND
U1 = CMP-0122421-1: Sensorless Field Oriented Control (FOC) Integrated FET BLDC Driver; Manufacturer: Texas Instruments; SizeZ_mm: 1mm; AEC Qualified: Yes; AEC Grade: Grade 1; Max Supply Voltage: 35V; Min Supply Voltage: 4.5V; Motor Type: Brushless DC; Nominal Supply Current: 11-28mA; Number Of Outputs: 3; Standoff Height: 0mm; TaMax_C: +125°C; TaMin_C: -40°C; TJmax_C: +150°C; PackageReference: VQFN40; PartNumber: MCF8315C1VQRGFRQ1; RoHS: TRUE; Operating Temperature Range: -40°C to +125°C; Part Number: MCF8315C1VQRGFRQ1; datasheet: https://www.ti.com/lit/ds/symlink/mcf8315c-q1.pdf; Datasheet Path: datasheets/IC-MCF8315C1VQRGFRQ1.pdf; Digikey Description: AUTOMOTIVE, 40V MAX, 4A PEAK, SE; Digikey Part Number: 296-MCF8315C1VQRGFRQ1CT-ND; helpURL: https://upverter.com/upn/revision/513decdd14bf9ffb/; Lead Free: Yes; Mouser Part Number: 595-MCF8315C1VQRGFQ1; ComponentLink1Description: Datasheet; ComponentLink1URL: https://www.ti.com/lit/ds/symlink/mcf8315c-q1.pdf

## Sheet MD070B_HARDWARE.SchDoc
size 431 x 279 mm; Date: Not shown in title block; ApprovedBy: Not shown in title block; CheckedBy: Not shown in title block; Author: Not shown in title block; CompanyName: Not shown in title block; Engineer: Not shown in title block; Organization: Not shown in title block; Address1: Not shown in title block; Address2: Not shown in title block; Address3: Not shown in title block; Address4: Not shown in title block; DocumentNumber: 3; Revision: Use project parameter SCH_Rev; SheetNumber: 5; SheetTotal: 5; PageSetup: Record=PageOptions|CenterHorizontal=True|CenterVertical=True|PrintScale=1.00|XCorrection=1.00|YCorrection=1.00|PrintKind=0|BorderSize=5000000|LeftOffset=0|BottomOffset=0|Orientation=2|PaperLength=1000|PaperWidth=1000|Scale=100|PaperSource=15|PrintQuality=600|MediaType=1|DitherType=10|PaperKind=Letter|PrintScaleMode=1; CurrentTime: Not shown in title block; CurrentDate: Not shown in title block; Time: Not shown in title block; DocumentFullPathAndName: Not shown in title block; DocumentName: Not shown in title block; ModifiedDate: Not shown in title block; ImagePath: Not shown in title block
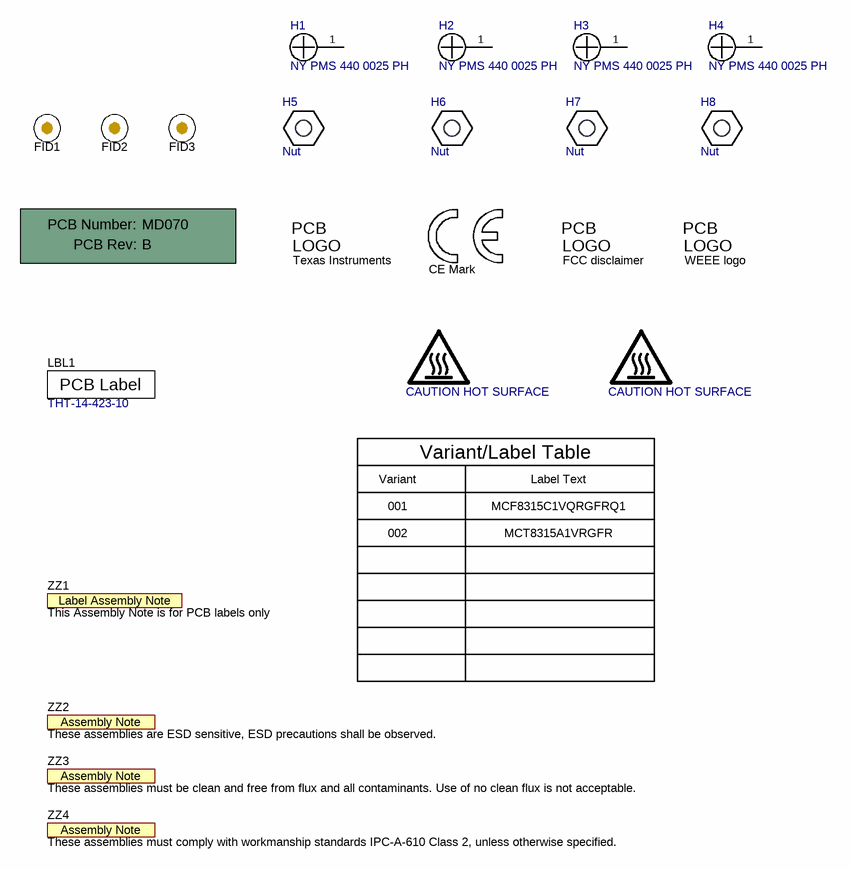
[diagram p2: MD070B_HARDWARE.SchDoc]

### Parts
!PCB1  Printed Circuit Board  (value not drawn)  (mechanical)
FID1  Fiducial  [Fiducial10-20]  (value not drawn)
FID2  Fiducial  [Fiducial10-20]  (value not drawn)
FID3  Fiducial  [Fiducial10-20]  (value not drawn)
H1  NY PMS 440 0025 PH  [NY PMS 440 0025 PH]
H2  NY PMS 440 0025 PH  [NY PMS 440 0025 PH]
H3  NY PMS 440 0025 PH  [NY PMS 440 0025 PH]
H4  NY PMS 440 0025 PH  [NY PMS 440 0025 PH]
H5  Nut  [Keystone_1902C]
H6  Nut  [Keystone_1902C]
H7  Nut  [Keystone_1902C]
H8  Nut  [Keystone_1902C]
LBL1  THT-14-423-10  [Label_650x200]
Logo1  CE Mark  [CE_Mark_5mm]  (no BOM)
Logo2  Texas Instruments  [TI_Stacked_Overlay_Small]  (no BOM)
Logo3  FCC disclaimer  [FCC_disclaimer]  (no BOM)
Logo4  WEEE logo  [WEEE_Minimum]  (no BOM)
LOGO5  CAUTION HOT SURFACE  [IEC_HotSurface_Small]  (no BOM)
LOGO6  CAUTION HOT SURFACE  [IEC_HotSurface_Small]  (no BOM)
ZZ1  This Assembly Note is for PCB labels only  [AssemblyNoteLabel]  (no BOM)
ZZ2  These assemblies are ESD sensitive, ESD precautions shall be observed.  [AssemblyNote]  (no BOM)
ZZ3  These assemblies must be clean and free from flux and all contaminants. Use of no clean flux is not acceptable.  [AssemblyNote]  (no BOM)
ZZ4  These assemblies must comply with workmanship standards IPC-A-610 Class 2, unless otherwise specified.  [AssemblyNote]  (no BOM)

### Nets

Not connected (* = marked no-connect by the designer): H1 1; H2 1; H3 1; H4 1

### Notes on the sheet
- Variant
- Variant/Label Table
- Label Text
- 001
- 002
- MCF8315C1VQRGFRQ1
- MCT8315A1VRGFR
- Drawn By:
- SVN Rev:
- Number:
- TID #:
- Orderable:
- Rev:
- Sheet Title:
- File:
- Project Title:
- Designed for:
- Assembly Variant:
- Mod. Date:
- Sheet:
- Size:
- of
- B
- http://www.ti.com
- Texas Instruments and/or its licensors do not warrant the accuracy or completeness of this specification or any information contained therein. Texas Instruments and/or its licensors do not warrant that this design will meet the specifications, will be suitable for your application or fit for any particular purpose, or will operate in an implementation. Texas Instruments and/or its licensors do not warrant that the design is production worthy. You should completely validate and test your design implementation to confirm the system functionality for your application.
- Engineer:
- Contact:
- © Texas Instruments
- (in symbol CMP-0003616-3) Label Assembly Note
- (in symbol CMP-0003618-2) PCB Number:; PCB Rev:
- (in symbol CMP-0003625-1) PCB Label
- (in symbol CMP-0074769-1) PCB; LOGO
- (in symbol CMP-0074838-1) PCB; LOGO
- (in symbol CMP-0074847-1) PCB; LOGO

### Library data of the parts
!PCB1 = CMP-0003618-2: Manufacturer: Any; PartNumber: MD070; CompType: PCB; RoHS: O; MountType: N/A; Publisher: Texas Instruments; LatestRevisionDate: 2017-03-09; Key: PCB
FID1-FID3 = CMP-0077181-1: Fiducial mark.  There is nothing to buy or mount.; CompType: Fiducial; Manufacturer: N/A; MountType: N/A; PackageReference: N/A; PartNumber: N/A; ClassName: FiducialMark; Library Reference: Fiducial
H1-H4 = CMP-0003617-1: Machine Screw, Round, #4-40 x 1/4, Nylon, Philips panhead; Manufacturer: B&F Fastener Supply; CompType: Hardware; MountType: N/A; RoHS: Y; PartNumber: NY PMS 440 0025 PH; PackageReference: Screw; ComponentLink1Description: Datasheet Link; ComponentLink1URL: http://www.fasnetdirect.com/refguide/Nylpanms.pdf; ClassName: Mounting Holes; LatestRevisionDate: 2017-03-09; Publisher: Texas Instruments; Supplier 1: Digi-Key; Supplier Part Number 1: H542-ND; Key: NY PMS 440 0025 PH
H5-H8 = CMP-0003610-1: Standoff, Hex, 0.5"L #4-40 Nylon; Manufacturer: Keystone; PartNumber: 1902C; CompType: Hardware; MountType: N/A; RoHS: Y; PackageReference: Standoff; ComponentLink1Description: Datasheet Link; ComponentLink1URL: http://www.keyelco.com/pdfs/M55-prod31.pdf; LatestRevisionDate: 2017-03-09; Publisher: Texas Instruments; Supplier 1: Digi-Key; Supplier Part Number 1: 36-1902C-ND; Key: 1902C
LBL1 = CMP-0003625-1: Manufacturer: Brady; ComponentLink1URL: http://www.bradyid.com/bradyid/pdpv/THT-14-423-10.html; Key: THT-14-423-10; Publisher: Texas Instruments; Supplier Part Number 2: 2065596; Supplier 1: Newark; CompType: Label; PackageReference: PCB Label 0.650 x 0.200 inch; LatestRevisionDate: 2017-03-09; ClassName: Label; RoHS: Y; Supplier Part Number 1: 97C5133; MountType: N/A; Supplier 2: Farnell; PartNumber: THT-14-423-10; ComponentLink1Description: Web Page
Logo1 = CMP-0074844-1: SymbolCreator: a0412235; Published: 2009-03-03; Publisher: Texas Instruments; LatestRevisionDate: 2017-07-06; Lib Reference: CE Mark; PartNumber: CE Mark; Library Reference: CE Mark
Logo2 = CMP-0074838-1: Texas Instrument Corporate Signature; SymbolCreator: a0412235; Lib Reference: TI_Logo; Library Reference: Logo; SymbolVersion: 2011-08-22; Published: 2009-03-03; Publisher: Texas Instruments; ClassName: Logo; LatestRevisionDate: 2017-07-06; PartNumber: Texas Instruments
Logo3 = CMP-0074847-1: FCC_disclaimer; Library Reference: Logo; Published: 2009-03-03; Publisher: Texas Instruments; LatestRevisionDate: 2017-07-06; Lib Reference: FCC_disclaimer; PartNumber: FCC disclaimer
Logo4 = CMP-0074769-1: Library Reference: WEEE logo; Lib Reference: WEEE logo; PartNumber: WEEE logo
LOGO5 LOGO6 = CMP-0074837-1: IEC 61010-1 Hot Surface Warning; SymbolCreator: a0412235; Library Reference: IEC_HotSurface; Publisher: Texas Instruments; SymbolVersion: 2011-08-22; Published: 2009-03-03; Lib Reference: IEC_HotSurface; LatestRevisionDate: 2017-07-06; PartNumber: CAUTION HOT SURFACE
ZZ1 = CMP-0003616-3: CompType: AssemblyNote; ClassName: AssemblyNote; Publisher: Texas Instruments; LatestRevisionDate: 2017-03-09; Key: AssemblyNoteLabel
ZZ2 = CMP-0077236-1: CompType: AssemblyNote; ClassName: AssemblyNote; Publisher: Texas Instruments; LatestRevisionDate: 2017-08-10; Key: AssemblyNote
ZZ3 = CMP-0077237-1: CompType: AssemblyNote; ClassName: AssemblyNote; Publisher: Texas Instruments; LatestRevisionDate: 2017-08-10; Key: AssemblyNote
ZZ4 = CMP-0077238-1: CompType: AssemblyNote; ClassName: AssemblyNote; Publisher: Texas Instruments; LatestRevisionDate: 2017-08-10; Key: AssemblyNote